# Altium schematic sheet MCU_Sheet1.SchDoc
size A3; SheetNumber: 1; SheetTotal: 3
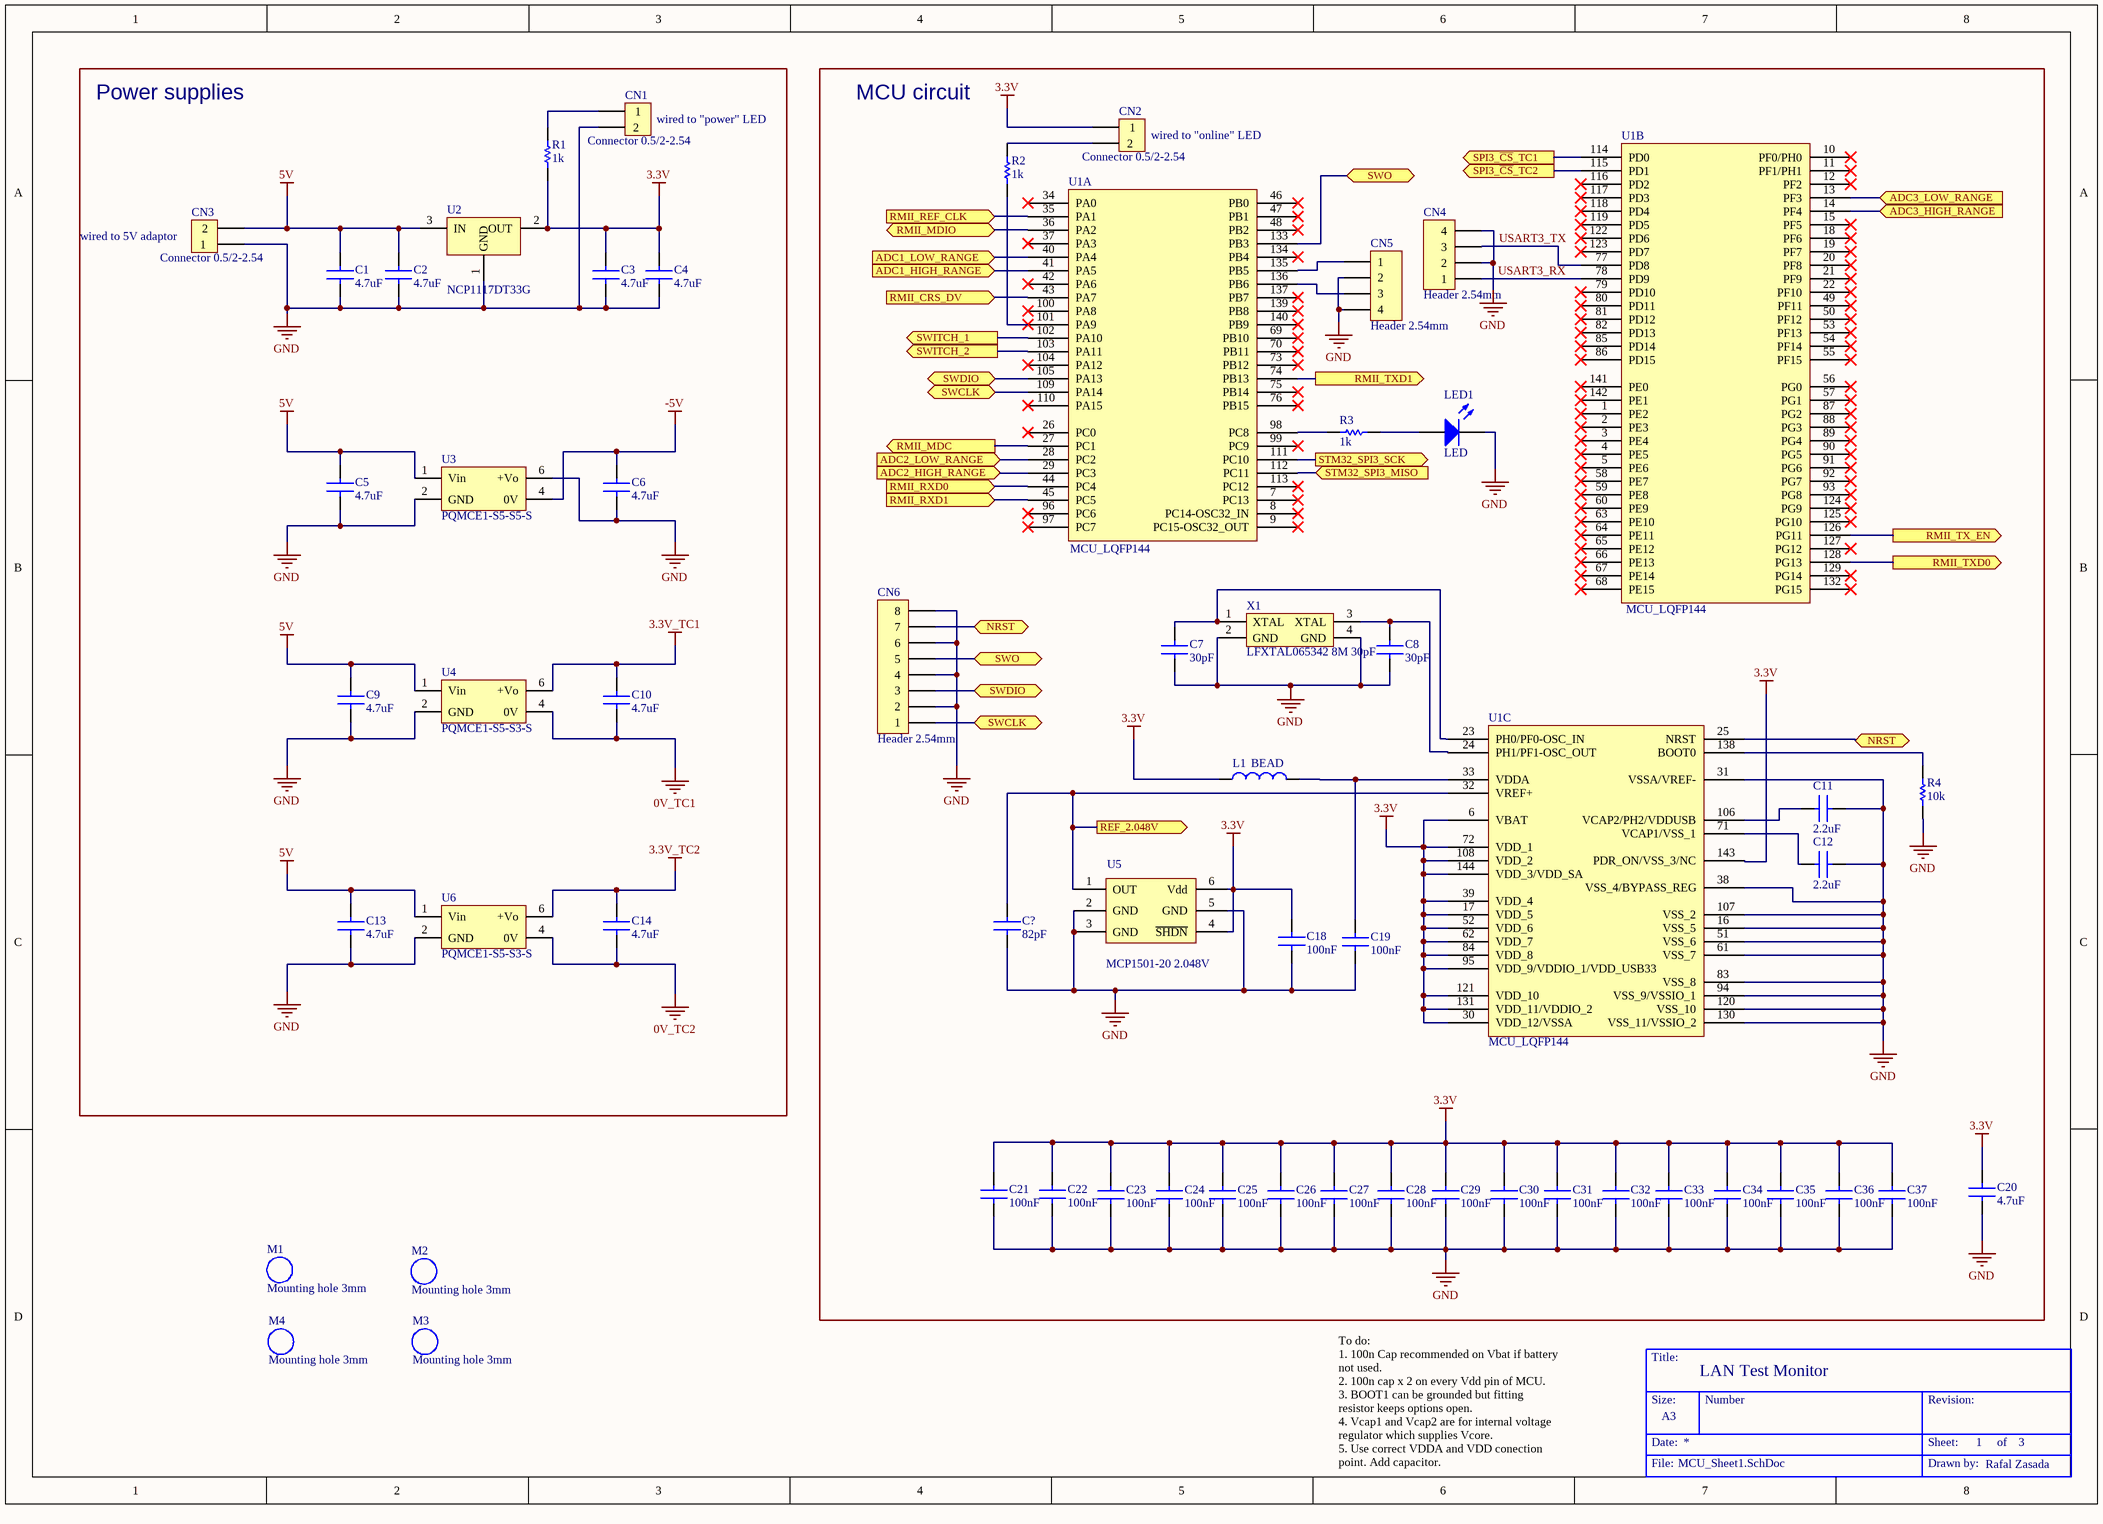
[diagram p0: MCU_Sheet1.SchDoc]

## Parts
*  Title Block  (value not drawn)  (graphical)
C1  4.7uF  [Cap_0603]
C2  4.7uF  [Cap_0603]
C3  4.7uF  [Cap_0603]
C4  4.7uF  [Cap_0603]
C5  4.7uF  [Cap_0603]
C6  4.7uF  [Cap_0603]
C7  30pF  [Cap_0603]
C8  30pF  [Cap_0603]
C9  4.7uF  [Cap_0603]
C10  4.7uF  [Cap_0603]
C11  2.2uF  [Cap_0603]
C12  2.2uF  [Cap_0603]
C13  4.7uF  [Cap_0603]
C14  4.7uF  [Cap_0603]
C18  100nF  [Cap_0603]
C19  100nF  [Cap_0603]
C20  4.7uF  [Cap_0603]
C21  100nF  [Cap_0603]
C22  100nF  [Cap_0603]
C23  100nF  [Cap_0603]
C24  100nF  [Cap_0603]
C25  100nF  [Cap_0603]
C26  100nF  [Cap_0603]
C27  100nF  [Cap_0603]
C28  100nF  [Cap_0603]
C29  100nF  [Cap_0603]
C30  100nF  [Cap_0603]
C31  100nF  [Cap_0603]
C32  100nF  [Cap_0603]
C33  100nF  [Cap_0603]
C34  100nF  [Cap_0603]
C35  100nF  [Cap_0603]
C36  100nF  [Cap_0603]
C37  100nF  [Cap_0603]
C?  82pF  [Cap_0603]
CN1  Connector 0.5/2-2.54  [Connector 0.5/2-2.54]
CN2  Connector 0.5/2-2.54  [Connector 0.5/2-2.54]
CN3  Connector 0.5/2-2.54  [Connector 0.5/2-2.54]
CN4  Header 2.54mm  [header 2.54mm 4way]
CN5  Header 2.54mm  [header 2.54mm 4way]
CN6  Header 2.54mm  [header 2.54mm 8way]
L1  BEAD  [Cap_0603]
LED1  LED  [LED 0603]
M1  Mounting hole 3mm  [Mounting_Hole_3mm]
M2  Mounting hole 3mm  [Mounting_Hole_3mm]
M3  Mounting hole 3mm  [Mounting_Hole_3mm]
M4  Mounting hole 3mm  [Mounting_Hole_3mm]
R1  1k  [Res_0603]
R2  1k  [Res_0603]
R3  1k  [Res_0603]
R4  10k  [Res_0603]
U1  MCU_LQFP144  [LQFP144_0R5_SKT]  (parts A,B,C of 3)
U2  NCP1117DT33G  [DPACK]
U3  PQMCE1-S5-S5-S  [PQMCE1 (DC-DC conv.)]
U4  PQMCE1-S5-S3-S  [PQMCE1 (DC-DC conv.)]
U5  MCP1501-20 2.048V  [SOT23 MCP1501]
U6  PQMCE1-S5-S3-S  [PQMCE1 (DC-DC conv.)]
X1  LFXTAL065342 8M 30pF  [LFXTAL065342Reel]

## Blocks framed on the sheet
Power supplies: C1-C6 C9 C10 C13 C14 CN1 CN3 R1 U2-U4 U6
MCU circuit: C7 C8 C11 C12 C18-C37 C? CN2 CN4-CN6 L1 LED1 R2-R4 U1 U5 X1

## Ports
ADC1_HIGH_RANGE (in), ADC1_LOW_RANGE (in), ADC2_HIGH_RANGE (in), ADC2_LOW_RANGE (in), ADC3_HIGH_RANGE (in), ADC3_LOW_RANGE (in), NRST (bidir), REF_2.048V (out), RMII_CRS_DV (in), RMII_MDC (out), RMII_MDIO (bidir), RMII_REF_CLK (in), RMII_RXD0 (in), RMII_RXD1 (in), RMII_TX_EN (out), RMII_TXD0 (out), RMII_TXD1 (out), SPI3_~{CS}_TC1 (out), SPI3_~{CS}_TC2 (out), STM32_SPI3_MISO (in), STM32_SPI3_SCK (out), SWCLK (bidir), SWDIO (bidir), SWITCH_1 (out), SWITCH_2 (out), SWO (bidir)

## Nets
0V_TC1: C10.1 U4.4(0V)
0V_TC2: C14.1 U6.4(0V)
3.3V: C3.2 C4.2 C18.2 C20.2 C21.2 C22.2 C23.2 C24.2 C25.2 C26.2 C27.2 C28.2 C29.2 C30.2 C31.2 C32.2 C33.2 C34.2 C35.2 C36.2 C37.2 CN2.1 L1.1 R1.1 U1.6(VBAT) U1.17(VDD_5) U1.30(VDD_12/VSSA) U1.39(VDD_4) U1.52(VDD_6) U1.62(VDD_7) U1.72(VDD_1) U1.84(VDD_8) U1.95(VDD_9/VDDIO_1/VDD_USB33) U1.108(VDD_2) U1.121(VDD_10) U1.131(VDD_11/VDDIO_2) U1.143(PDR_ON/VSS_3/NC) U1.144(VDD_3/VDD_SA) U2.2(OUT) U5.4(~{SHDN}) U5.6(Vdd)
3.3V_TC1: C10.2 U4.6(+Vo)
3.3V_TC2: C14.2 U6.6(+Vo)
5V: C1.2 C2.2 C5.2 C9.2 C13.2 CN3.2 U2.3(IN) U3.1(Vin) U4.1(Vin) U6.1(Vin)
-5V: C6.2 U3.4(0V)
GND: C1.1 C2.1 C3.1 C4.1 C5.1 C6.1 C7.1 C8.1 C9.1 C11.2 C12.2 C13.1 C18.1 C19.1 C20.1 C21.1 C22.1 C23.1 C24.1 C25.1 C26.1 C27.1 C28.1 C29.1 C30.1 C31.1 C32.1 C33.1 C34.1 C35.1 C36.1 C37.1 C?.1 CN1.2 CN3.1 CN4.2 CN4.4 CN5.2 CN5.4 CN6.2 CN6.4 CN6.6 CN6.8 LED1.2(K) R4.1 U1.16(VSS_5) U1.31(VSSA/VREF-) U1.38(VSS_4/BYPASS_REG) U1.51(VSS_6) U1.61(VSS_7) U1.83(VSS_8) U1.94(VSS_9/VSSIO_1) U1.107(VSS_2) U1.120(VSS_10) U1.130(VSS_11/VSSIO_2) U2.1(GND) U3.2(GND) U3.6(+Vo) U4.2(GND) U5.2(GND) U5.3(GND) U5.5(GND) U6.2(GND) X1.2(GND) X1.4(GND)
ADC1_HIGH_RANGE: U1.41(PA5) ; port ADC1_HIGH_RANGE
ADC1_LOW_RANGE: U1.40(PA4) ; port ADC1_LOW_RANGE
ADC2_HIGH_RANGE: U1.29(PC3) ; port ADC2_HIGH_RANGE
ADC2_LOW_RANGE: U1.28(PC2) ; port ADC2_LOW_RANGE
ADC3_HIGH_RANGE: U1.14(PF4) ; port ADC3_HIGH_RANGE
ADC3_LOW_RANGE: U1.13(PF3) ; port ADC3_LOW_RANGE
NRST: CN6.7 U1.25(NRST) ; port NRST
REF_2.048V: C?.2 U1.32(VREF+) U5.1(OUT) ; port REF_2.048V
RMII_CRS_DV: U1.43(PA7) ; port RMII_CRS_DV
RMII_MDC: U1.27(PC1) ; port RMII_MDC
RMII_MDIO: U1.36(PA2) ; port RMII_MDIO
RMII_REF_CLK: U1.35(PA1) ; port RMII_REF_CLK
RMII_RXD0: U1.44(PC4) ; port RMII_RXD0
RMII_RXD1: U1.45(PC5) ; port RMII_RXD1
RMII_TX_EN: U1.126(PG11) ; port RMII_TX_EN
RMII_TXD0: U1.128(PG13) ; port RMII_TXD0
RMII_TXD1: U1.74(PB13) ; port RMII_TXD1
SPI3_~{CS}_TC1: U1.114(PD0) ; port SPI3_~{CS}_TC1
SPI3_~{CS}_TC2: U1.115(PD1) ; port SPI3_~{CS}_TC2
STM32_SPI3_MISO: U1.112(PC11) ; port STM32_SPI3_MISO
STM32_SPI3_SCK: U1.111(PC10) ; port STM32_SPI3_SCK
SWCLK: CN6.1 U1.109(PA14) ; port SWCLK
SWDIO: CN6.3 U1.105(PA13) ; port SWDIO
SWITCH_1: U1.102(PA10) ; port SWITCH_1
SWITCH_2: U1.103(PA11) ; port SWITCH_2
SWO: CN6.5 U1.133(PB3) ; port SWO
USART3_RX: CN4.1 U1.78(PD9)
USART3_TX: CN4.3 U1.77(PD8)
NetC7_2: C7.2 U1.23(PH0/PF0-OSC_IN) X1.1(XTAL)
NetC8_2: C8.2 U1.24(PH1/PF1-OSC_OUT) X1.3(XTAL)
NetC11_1: C11.1 U1.106(VCAP2/PH2/VDDUSB)
NetC12_1: C12.1 U1.71(VCAP1/VSS_1)
NetC19_2: C19.2 L1.2 U1.33(VDDA)
NetCN1_1: CN1.1 R1.2
NetCN2_2: CN2.2 R2.2
NetCN5_1: CN5.1 U1.135(PB5)
NetCN5_3: CN5.3 U1.136(PB6)
NetLED1_1: LED1.1(A) R3.2
NetR2_1: R2.1 U1.101(PA9)
NetR3_1: R3.1 U1.98(PC8)
NetR4_2: R4.2 U1.138(BOOT0)

Not connected (* = marked no-connect by the designer): U1 1(PE2)* 2(PE3)* 3(PE4)* 4(PE5)* 5(PE6)* 7(PC13)* 8(PC14-OSC32_IN)* 9(PC15-OSC32_OUT)* 10(PF0/PH0)* 11(PF1/PH1)* 12(PF2)* 15(PF5)* 18(PF6)* 19(PF7)* 20(PF8)* 21(PF9)* 22(PF10)* 26(PC0)* 34(PA0)* 37(PA3)* 42(PA6)* 46(PB0)* 47(PB1)* 48(PB2)* 49(PF11)* 50(PF12)* 53(PF13)* 54(PF14)* 55(PF15)* 56(PG0)* 57(PG1)* 58(PE7)* 59(PE8)* 60(PE9)* 63(PE10)* 64(PE11)* 65(PE12)* 66(PE13)* 67(PE14)* 68(PE15)* 69(PB10)* 70(PB11)* 73(PB12)* 75(PB14)* 76(PB15)* 79(PD10)* 80(PD11)* 81(PD12)* 82(PD13)* 85(PD14)* 86(PD15)* 87(PG2)* 88(PG3)* 89(PG4)* 90(PG5)* 91(PG6)* 92(PG7)* 93(PG8)* 96(PC6)* 97(PC7)* 99(PC9)* 100(PA8)* 104(PA12)* 110(PA15)* 113(PC12)* 116(PD2)* 117(PD3)* 118(PD4)* 119(PD5)* 122(PD6)* 123(PD7)* 124(PG9)* 125(PG10)* 127(PG12)* 129(PG14)* 132(PG15)* 134(PB4)* 137(PB7)* 139(PB8)* 140(PB9)* 141(PE0)* 142(PE1)*

## Notes on the sheet
- (near CN1) wired to "power" LED
- (near CN2) wired to "online" LED
- (near CN3) wired to 5V adaptor
- To do:
  1. 100n Cap recommended on Vbat if battery not used.
  2. 100n cap x 2 on every Vdd pin of MCU.
  3. BOOT1 can be grounded but fitting resistor keeps options open.
  4. Vcap1 and Vcap2 are for internal voltage regulator which supplies Vcore.
  5. Use correct VDDA and VDD conection point. Add capacitor.
- A3
- Rafal Zasada
- (in symbol Title Block) Title:; LAN Test Monitor; Size:; Number; Revision:; Date:; Sheet:; of; File:; Drawn by:

## Library data of the parts
C1-C6 C9 C10 C13 C14 C20 = Cap 4.7uF 0603 10%
C7 C8 = Cap 30 pF 0603
C11 C12 = Cap 2.2uF 0603 10%
C18 C19 C21-C37 = Cap 100nF 0603 10%
C? = Cap 82pF 0603 10%
CN1-CN3 = Phoenix Contact MPT 0.5/2-2.54
CN4 CN5 = Header plug 2.54mm 4 way
CN6 = Header plug 2.54mm 8 way
L1 = Inductor: Value: 100uH; Published: 8-Jun-2000; Revision: July-2002: Re-released for DXP Platform.; Publisher: Altium Limited
LED1 = LED 0603
R1-R3 = Res 1k 1% 0603: Manuf_Part_1: MCT 0603-50 1% P5 12K1; Manuf_1: VISHAY; Value: 12K1; Order: 2325243; ECCN_US/EU: n/a; Distrib: FARNELL
R4 = Res 10k 1% 0603: Manuf_Part_1: MCT 0603-50 1% P5 12K1; Manuf_1: VISHAY; Value: 12K1; Order: 2325243; ECCN_US/EU: n/a; Distrib: FARNELL
U2 = NCP1117DT33G: Voltage regulator output 3.3V 800mA (JLC PCB) DPACK
U3 = PQMCE1-S5-S5-S: DC-DC isolated coverter 5V to 5V
U4 U6 = PQMCE1-S5-S3-S: DC-DC isolated coverter 5V to 3.3V
U5 = MCP1501: Voltage reference MCP1501T-20E/CHY
X1 = LFXTAL065342